# Altium schematic sheet Blue_Clipper.SchDoc
size A4; SheetNumber: 1; SheetTotal: 1
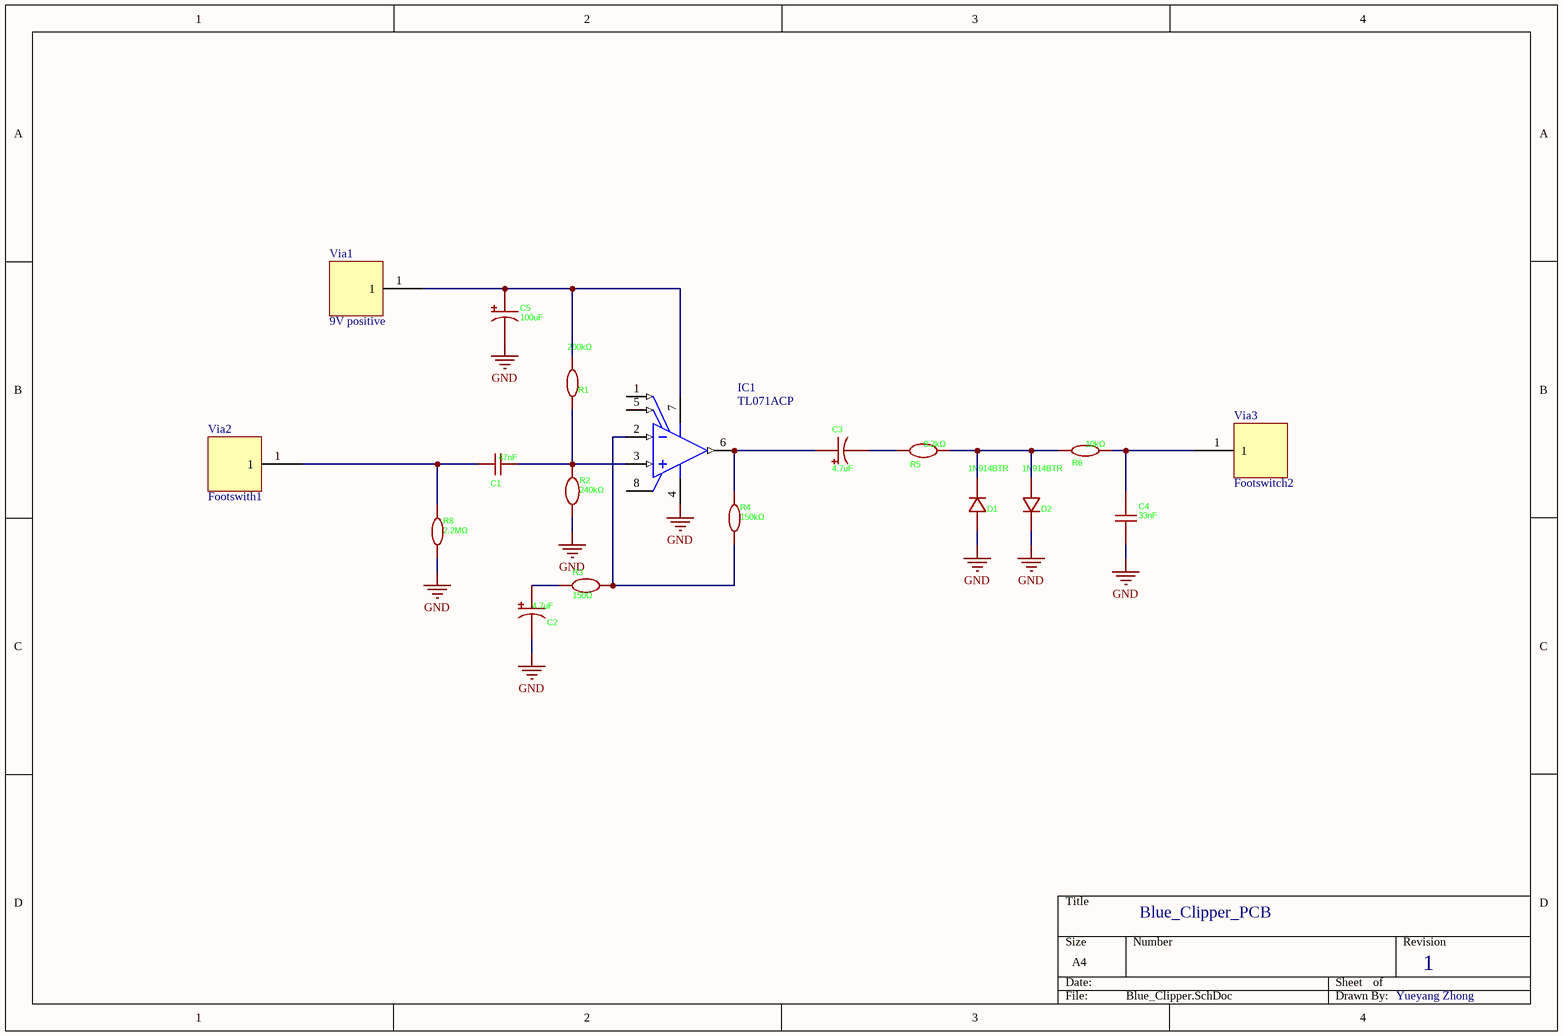
[diagram p0: Blue_Clipper.SchDoc]

## Parts
C1  47nF  [47nF]
C2  4.7uF  [4.7uF]
C3  4.7uF  [4.7uF]
C4  33nF  [33nF]
C5  100uF  [100nF]
D1  1N914BTR  [DO-35_BD2.0-L4.2-P8.20-D0.5-RD]
D2  1N914BTR  [DO-35_BD2.0-L4.2-P8.20-D0.5-RD]
IC1  TL071ACP  [P0008A]
R1  200kΩ  [200K]
R2  240kΩ  [240K]
R3  150Ω  [150]
R4  150kΩ  [150K]
R5  8.2kΩ  [8K2]
R6  10kΩ  [10K]
R8  2.2MΩ  [2.2M]
Via1  9V positive  [PCBComponent_1]
Via2  Footswith1  [PCBComponent_1]
Via3  Footswitch2  [PCBComponent_1]

## Nets
GND: C2.2 C4.1 C5.2 D1.2 D2.1 IC1.4(VCC-) R2.1 R8.1
NetC1_1: C1.1 R8.2 Via2.1
NetC1_2: C1.2 IC1.3(IN+) R1.1 R2.2
NetC2_1: C2.1 R3.2
NetC3_1: C3.1 IC1.6(OUT) R4.1
NetC3_2: C3.2 R5.1
NetC4_2: C4.2 R6.2 Via3.1
NetC5_1: C5.1 IC1.7(VCC+) R1.2 Via1.1
NetD1_1: D1.1 D2.2 R5.2 R6.1
NetIC1_2: IC1.2(IN-) R3.1 R4.2

Not connected (* = marked no-connect by the designer): IC1 1(OFFSET_N1) 5(OFFSET_N2) 8(NC)

## Notes on the sheet
- Blue_Clipper_PCB
- 1
- Yueyang Zhong

## Library data of the parts
C1 = MPP473K2E1304095LC: Manufacturer: SRD(圣融达); Symbol: MPP473K2130409LC; Add into BOM: yes; Tolerance: ±10%; Device: MPP473K2E1304095LC; LCSC Part Name: 47nF ±10%; Supplier Part: C109757; Manufacturer Part: MPP473K2E1304095LC; Supplier Footprint: 插件; JLCPCB Part Class: Extended Part; Datasheet: https://atta.szlcsc.com/upload/public/pdf/source/20190820/C412730_D7BCD9B1AADCF68DA4089841D58A28D3.pdf; Supplier: LCSC; Convert to PCB: yes; Value: 47nF; Voltage Rated: -; Operating Temperature: -40℃~+85℃
C2 C3 = UUD1V4R7MCL1GS: Manufacturer: Nichicon(尼吉康); Add into BOM: yes; Tolerance: ±20%; Rated Voltage: 35V; Ripple Current: 80mA@100kHz; Equivalent Series Resistance(ESR): 1.8Ω@100kHz; φD: 4mm; L: 6.1mm; Lifetime @ Temp: 2000hrs@105℃; Symbol: UUD1V4R7MCL1GS; Device: UUD1V4R7MCL1GS; LCSC Part Name: 4.7uF ±20% 35V; Supplier Part: C445250; Manufacturer Part: UUD1V4R7MCL1GS; Supplier Footprint: SMD,D4xL5.8mm; JLCPCB Part Class: Extended Part; Datasheet: https://atta.szlcsc.com/upload/public/pdf/source/20191118/C445283_CAA4D2A16DB999FCD0228FD197EA979A.pdf; Supplier: LCSC; Convert to PCB: yes; Value: 4.7uF; Operating Temperature: -55℃~+105℃
C4 = KP333J2J1001: Manufacturer: KYET(科雅); Add into BOM: yes; Tolerance: ±5%; Voltage Rated: 630V; Symbol: KP333J2J1001; Device: KP333J2J1001; LCSC Part Name: 33nF ±5% 630V; Supplier Part: C390075; Manufacturer Part: KP333J2J1001; Supplier Footprint: 插件,P=10mm; JLCPCB Part Class: Extended Part; Datasheet: https://atta.szlcsc.com/upload/public/pdf/source/20190521/C390075_294CBABFDD83AEA9E31C0E739F669EAE.pdf; Supplier: LCSC; Convert to PCB: yes; Value: 33nF; Operating Temperature: -40℃~+100℃
C5 = 50TZV100M8X10.5: Manufacturer: rubycon(红宝石); Add into BOM: yes; Tolerance: ±20%; Rated Voltage: 50V; Ripple Current: 350mA@100kHz; φD: 8mm; L: 10.5mm; Lifetime @ Temp: 2000hrs@105℃; Symbol: 50TZV100M8X10.5; Device: 50TZV100M8X10.5; LCSC Part Name: 100uF ±20% 50V; Supplier Part: C2843277; Manufacturer Part: 50TZV100M8X10.5; Supplier Footprint: SMD,D8xL10.5mm; JLCPCB Part Class: Extended Part; Datasheet: https://atta.szlcsc.com/upload/public/pdf/source/20211104/B1322EC361622DC9F2E8A8FE84CAD829.pdf; Supplier: LCSC; Convert to PCB: yes; Value: 100uF; Equivalent Series Resistance(ESR): -; Operating Temperature: -55℃~+105℃
D1 D2 = 1N914BTR: Manufacturer: onsemi(安森美); Add into BOM: yes; Forward Voltage (Vf@If): 1V@100mA; Reverse Voltage (Vr): 100V; Rectified Current: 200mA; Reverse Leakage Current: 5uA@75V; Reverse Recovery Time (trr): 4ns; Symbol: 1N914BTR; Device: 1N914BTR; LCSC Part Name: 电压:100V 电流:200mA; Supplier Part: C258180; Manufacturer Part: 1N914BTR; Supplier Footprint: DO-35; JLCPCB Part Class: Extended Part; Datasheet: https://atta.szlcsc.com/upload/public/pdf/source/20180829/C258180_CB6548A256F883C48C8DDA869B34246C.pdf; Supplier: LCSC; Convert to PCB: yes; Diode Configuration: -; Operating Temperature: -55℃~+175℃@(Tj)
IC1 = CMP-0017-00976-2: Low-Noise JFET-Input Operational Amplifier, 7 to 36 V, 0 to 70 degC, 8-pin DIP (P8), Pb-Free (RoHS); Manufacturer: Texas Instruments; Number of Channels: 1; Slew Rate(Typ)(V/us): 13; Sub Family: General Purpose Amplifier, High Supply Voltage Amplifier (>=30V); Iq per channel(Max)(mA): 2.5; IIB(Max)(pA): 200; Vn at 1kHz(Typ)(nV/rtHz): 18; Rating: Catalog; Vio (25C)(Max)(mV): 6; CMRR(Min)(dB): 75; Total Supply Voltage(Min)(+5V is 5, +/-5V is 10): 7; GBW(Typ)(MHz): 3; Total Supply Voltage(Max)(+5V is 5, +/-5V is 10): 36; ComponentLink2URL: http://www.ti.com/lit/ds/symlink/tl071a.pdf; Code_JEDEC: MS-001; Eco-Plan: Pb-Free (RoHS); ComponentLink3Description: Package Specification; Mounting Technology: Through Hole; PackageVersion: 4040082/E, 04/2010; Offset Drift(Typ)(uV/C): 18; PackageDescription: 8-Pin Plastic In-Line, Body 9.59 x 6.35 mm, Pitch 2.54 mm; ComponentLink1Description: Manufacturer URL; DatasheetVersion: SLOS080J; ComponentLink3URL: http://www.ti.com/litv/pdf/mpdi001b; ComponentLink1URL: http://www.ti.com/; PartNumber: TL071ACP; ComponentLink2Description: Datasheet; PackageReference: P0008A
R1 = CR1W-200K±5%-TT52: 200K; Manufacturer: VO(翔胜); Add into BOM: yes; Tolerance: ±5%; Overload Voltage (Max): 500V; Power(Watts): 1W; Temperature Coefficient: ±350ppm/℃; Symbol: CR1W-200K±5%-TT52; Device: CR1W-200K±5%-TT52; LCSC Part Name: 碳膜电阻 200kΩ ±5% 1W; Supplier Part: C2897140; Manufacturer Part: CR1W-200K±5%-TT52; Supplier Footprint: 插件,D4.5xL11mm; JLCPCB Part Class: Extended Part; Datasheet: https://atta.szlcsc.com/upload/public/pdf/source/20210803/C2857407_45FF53FE186CAB545115AD37303966CD.pdf; Supplier: LCSC; Convert to PCB: yes; Type: 碳膜电阻; Value: 200kΩ; Operating Temperature Range: -55℃~+155℃
R2 = MO2W-240K±5%-9T73: 240K; Manufacturer: VO(翔胜); Add into BOM: yes; Tolerance: ±5%; Overload Voltage (Max): 400V; Power(Watts): 2W; Temperature Coefficient: ±350ppm/℃; Symbol: MO2W-240K±5%-9T73; Device: MO2W-240K±5%-9T73; LCSC Part Name: 金属氧化膜电阻 240kΩ ±5% 2W; Supplier Part: C601791; Manufacturer Part: MO2W-240K±5%-9T73; Supplier Footprint: 插件,D5xL15mm; JLCPCB Part Class: Extended Part; Datasheet: https://atta.szlcsc.com/upload/public/pdf/source/20200622/C479426_3144C92B6E787A18688D073F1B971656.pdf; Supplier: LCSC; Convert to PCB: yes; Type: 金属氧化膜电阻; Value: 240kΩ; Operating Temperature Range: -55℃~+155℃
R3 = CR1/2W-150Ω±5%-XT52: 150; Manufacturer: VO(翔胜); Add into BOM: yes; Tolerance: ±5%; Voltage-Supply(Max): 350V; Power(Watts): 500mW; Temperature Coefficient: ±350ppm/℃; Symbol: CR1/2W-150Ω±5%-XT52; Device: CR1/2W-150Ω±5%-XT52; LCSC Part Name: 碳膜电阻 150Ω ±5% 500mW 0.5镀锡铁脚 编带内跨距52MM; Supplier Part: C2894481; Manufacturer Part: CR1/2W-150Ω±5%-XT52; Supplier Footprint: 插件,D3.5xL9mm; JLCPCB Part Class: Extended Part; Datasheet: https://atta.szlcsc.com/upload/public/pdf/source/20210803/C2857407_45FF53FE186CAB545115AD37303966CD.pdf; Supplier: LCSC; Convert to PCB: yes; Type: 碳膜电阻; Value: 150Ω; Operating Temperature: -55℃~+155℃
R4 = MFR03SF1503A10: 150K; Manufacturer: UNI-ROYAL(厚声); Add into BOM: yes; Tolerance: ±1%; Voltage-Supply(Max): 500V; Power(Watts): 3W; Temperature Coefficient: ±50ppm/℃; Symbol: MFR03SF1503A10; Device: MFR03SF1503A10; LCSC Part Name: 150kΩ ±1% 3W 金属膜电阻 小体积,铜脚，圆柱状直插; Supplier Part: C89944; Manufacturer Part: MFR03SF1503A10; Supplier Footprint: 插件,D5xL15.5mm; JLCPCB Part Class: Extended Part; Datasheet: https://atta.szlcsc.com/upload/public/pdf/source/20191012/C436293_8820AA14BC71FA35E551C06C441482A0.pdf; Supplier: LCSC; Convert to PCB: yes; Type: 金属膜电阻; Value: 150kΩ
R5 = CR1/2W-8K2±5%-2T52: 8.2K; Manufacturer: VO(翔胜); Add into BOM: yes; Tolerance: ±5%; Voltage-Supply(Max): 350V; Power(Watts): 500mW; Temperature Coefficient: ±350ppm/℃; Symbol: CR1/2W-8K2±5%-2T52; Device: CR1/2W-8K2±5%-2T52; LCSC Part Name: 碳膜电阻 8.2kΩ ±5% 500mW 0.5镀锡铜脚 编带内跨距52MM; Supplier Part: C2894471; Manufacturer Part: CR1/2W-8K2±5%-2T52; Supplier Footprint: 插件,D3.5xL9mm; JLCPCB Part Class: Extended Part; Datasheet: https://atta.szlcsc.com/upload/public/pdf/source/20210803/C2857407_45FF53FE186CAB545115AD37303966CD.pdf; Supplier: LCSC; Convert to PCB: yes; Type: 碳膜电阻; Value: 8.2kΩ; Operating Temperature: -55℃~+155℃
R6 = CR1/2W-10K±5%-2T52: 10K; Manufacturer: VO(翔胜); Add into BOM: yes; Tolerance: ±5%; Voltage-Supply(Max): 350V; Power(Watts): 500mW; Temperature Coefficient: ±350ppm/℃; Symbol: CR1/2W-10K±5%-2T52; Device: CR1/2W-10K±5%-2T52; LCSC Part Name: 碳膜电阻 10kΩ ±5% 500mW 0.5镀锡铜脚 编带内跨距52MM; Supplier Part: C2894384; Manufacturer Part: CR1/2W-10K±5%-2T52; Supplier Footprint: 插件,D3.5xL9mm; JLCPCB Part Class: Extended Part; Datasheet: https://atta.szlcsc.com/upload/public/pdf/source/20210803/C2857407_45FF53FE186CAB545115AD37303966CD.pdf; Supplier: LCSC; Convert to PCB: yes; Type: 碳膜电阻; Value: 10kΩ; Operating Temperature: -55℃~+155℃
R8 = CF1/2W-2.2MΩ±5% T: 2.2M; Manufacturer: CCO(千志电子); Symbol: CF1/2W-2.2MΩ±5% T52; Add into BOM: yes; Tolerance: ±5%; Voltage-Supply(Max): 350V; Power(Watts): 500mW; Temperature Coefficient: ±350ppm/℃; Device: CF1/2W-2.2MΩ±5% T; LCSC Part Name: 2.2MΩ ±5% 500mW 碳膜电阻; Supplier Part: C120318; Manufacturer Part: CF1/2W-2.2MΩ±5% T; Supplier Footprint: 插件,D3.2xL9mm; JLCPCB Part Class: Extended Part; Datasheet: https://atta.szlcsc.com/upload/public/pdf/source/20190910/C427328_A0A2D65F3FD547937F4E674C90868175.pdf; Supplier: LCSC; Convert to PCB: yes; Type: 碳膜电阻; Value: 2.2MΩ; Operating Temperature: -55℃~+155℃
Via1-Via3 = Via